# Altium schematic sheet Simple_Counter.SchDoc
size A4
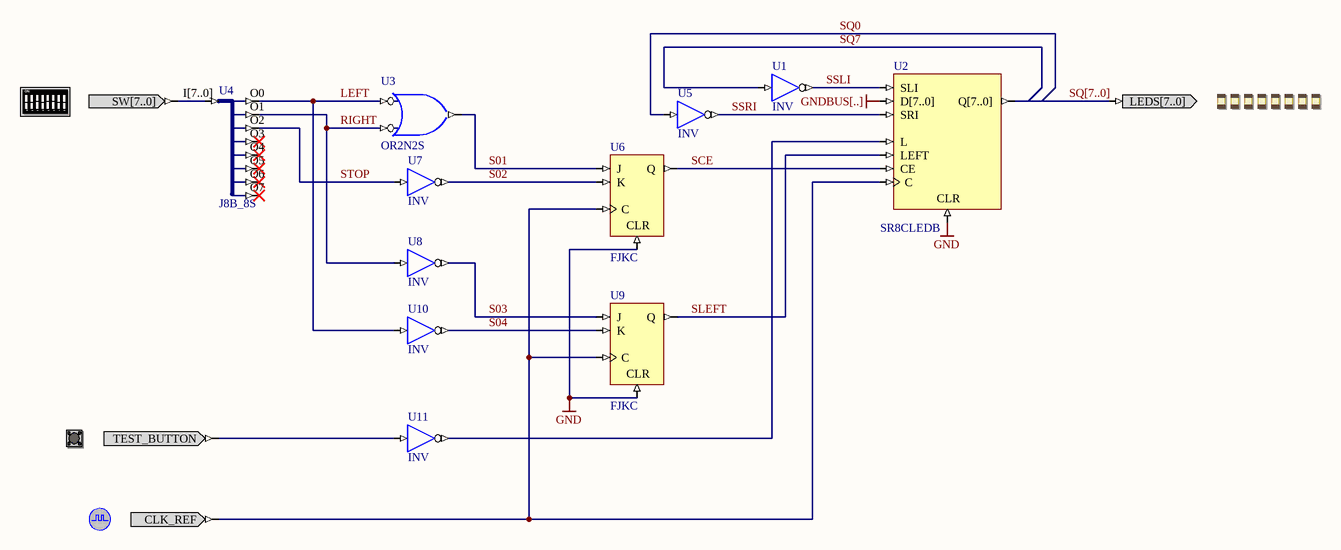
[diagram p0: Simple_Counter.SchDoc]

## Parts
(Parts that share a designator on the sheet are numbered #1, #2 ... from top to bottom, then left to right.)
?#1  DIPSWITCH  (value not drawn)
?#2  LED  (value not drawn)
?#3  TEST_BUTTON  (value not drawn)
?#4  CLOCK_REFERENCE  (value not drawn)
U1  INV
U2  SR8CLEDB
U3  OR2N2S
U4  J8B_8S
U5  INV
U6  FJKC
U7  INV
U8  INV
U9  FJKC
U10  INV
U11  INV

## Nets
GND: U2.CLR U6.CLR U9.CLR
GNDBUS[..]: U2.D[7..0]
LEFT: U3.I0 U4.O0 U10.I
RIGHT: U3.I1 U4.O1 U8.I
S01: U3.O U6.J
S02: U6.K U7.O
S03: U8.O U9.J
S04: U9.K U10.O
SCE: U2.CE U6.Q
SLEFT: U2.LEFT U9.Q
SQ0: U5.I
SQ7: U1.I
SQ[7..0]: ?#2.LEDS[7..0] U2.Q[7..0]
SSLI: U1.O U2.SLI
SSRI: U2.SRI U5.O
STOP: U4.O2 U7.I
Net?#1_SW[7..0]: ?#1.SW[7..0] U4.I[7..0]
Net?#3_TEST_BUTTON: ?#3.TEST_BUTTON U11.I
Net?#4_CLK_REF: ?#4.CLK_REF U2.C U6.C U9.C
NetU2_L: U2.L U11.O

Not connected (* = marked no-connect by the designer): U4 O3* O4* O5* O6* O7*

## Buses and harness runs
bus SQ[7..0]

## Notes on the sheet
- (in symbol DIPSWITCH) ON; 1; 2; 3; 4; 5; 6; 7; 8

## Library data of the parts
?#1 = DIPSWITCH: 8-Way Dip-Switch; PortComponent: True; Published: 19-Nov-2003; Publisher: Altium Limited; HelpURL: TR0143 Technical Reference Manual for Altium's Desktop NanoBoard NB2DSK01.pdf#page=51
?#2 = LED: Bank of eight Red LEDs; PortComponent: True; Published: 19-Nov-2003; Publisher: Altium Limited; HelpURL: TR0143 Technical Reference Manual for Altium's Desktop NanoBoard NB2DSK01.pdf#page=51
?#3 = TEST_BUTTON: Test / Reset Button; PortComponent: True; Published: 19-Nov-2003; Publisher: Altium Limited; HelpURL: TR0143 Technical Reference Manual for Altium's Desktop NanoBoard NB2DSK01.pdf#page=53
?#4 = CLOCK_REFERENCE: Global System Clock Reference Supply; PortComponent: True; Published: 19-Nov-2003; Publisher: Altium Limited; HelpURL: TR0143 Technical Reference Manual for Altium's Desktop NanoBoard NB2DSK01.pdf#page=41
U1 U5 U7 U8 U10 U11 = INV: Inverter; ArchiveName: GENERIC; Published: 9-30-2003; Publisher: Altium Limited; Xilinx Equivalent: INV; Core Revision: 1.00.00
U2 = SR8CLEDB: 8-Bit Loadable Serial/Parallel-In Parallel-Out Bidirectional Shift Registers with Clock Enable and Asynchronous Clear, Bus Version; ClockTrigger: Rising; Enable: High; Loadable: True; PortSize: 8; ArchiveName: GENERIC; VHDLIB_SIM: GENERIC_LIB; Published: 29-Jan-2004; Publisher: Altium Limited; XilinxEquivalent: SR8CLED; LastRevisionNo: 1.00.00; HelpURL: CR0118 FPGA Generic Library Guide.pdf#page=423; ComponentLink1URL: CR0141 FPGA Shift Register Resource Usage.pdf#page=17; ComponentLink1Description: Core &Resource Usage; FunctionalClass: Shift Register; Reset: Asynchronous; Direction: Bidirectional; PortStyle: Bus Version
U3 = OR2N2S: 2-Input OR Gate with Active Low A and B Inputs, Single Pin Version; XilinxEquivalent: OR2B2; FunctionalClass: Logic Primitive; PortSize: 2; ArchiveName: GENERIC; VHDLIB_SIM: GENERIC_LIB; Published: 29-Jan-2004; Publisher: Altium Limited; LastRevisionNo: 1.00.00; HelpURL: CR0118 FPGA Generic Library Guide.pdf#page=410; ComponentLink1URL: CR0136 FPGA Logic Primitive Resource Usage.pdf#page=189; ComponentLink1Description: Core &Resource Usage; SubClass: OR; PortStyle: Single Pin Version
U4 = J8B_8S: 8-Bit input bus to 8 single pin outputs; ArchiveName: GENERIC; Published: 4-Dec-2003; Publisher: Altium Limited; Core Revision: 1.00.00
U6 U9 = FJKC: J-K Flip-Flop with Asynchronous Clear; SubClass: JK; ClockTrigger: Rising; ArchiveName: GENERIC; VHDLIB_SIM: GENERIC_LIB; Published: 29-Jan-2004; Publisher: Altium Limited; XilinxEquivalent: FJKC; LastRevisionNo: 1.00.00; HelpURL: CR0118 FPGA Generic Library Guide.pdf#page=227; ComponentLink1URL: CR0133 FPGA Flip Flop Resource Usage.pdf#page=196; ComponentLink1Description: Core &Resource Usage; FunctionalClass: Flip-Flop; Reset: Asynchronous